# EasyEDA Pro project ir2104_V2.1.eprj

# Schematic Schematic1
Create Date: 2023-10-16; Page Name: P1_1; Project Name: ir2104_V2; Schematic Name: Schematic1; Update Date: 2023-10-16; Company: 嘉立创EDA; Page Size: A4; Version: V1.0
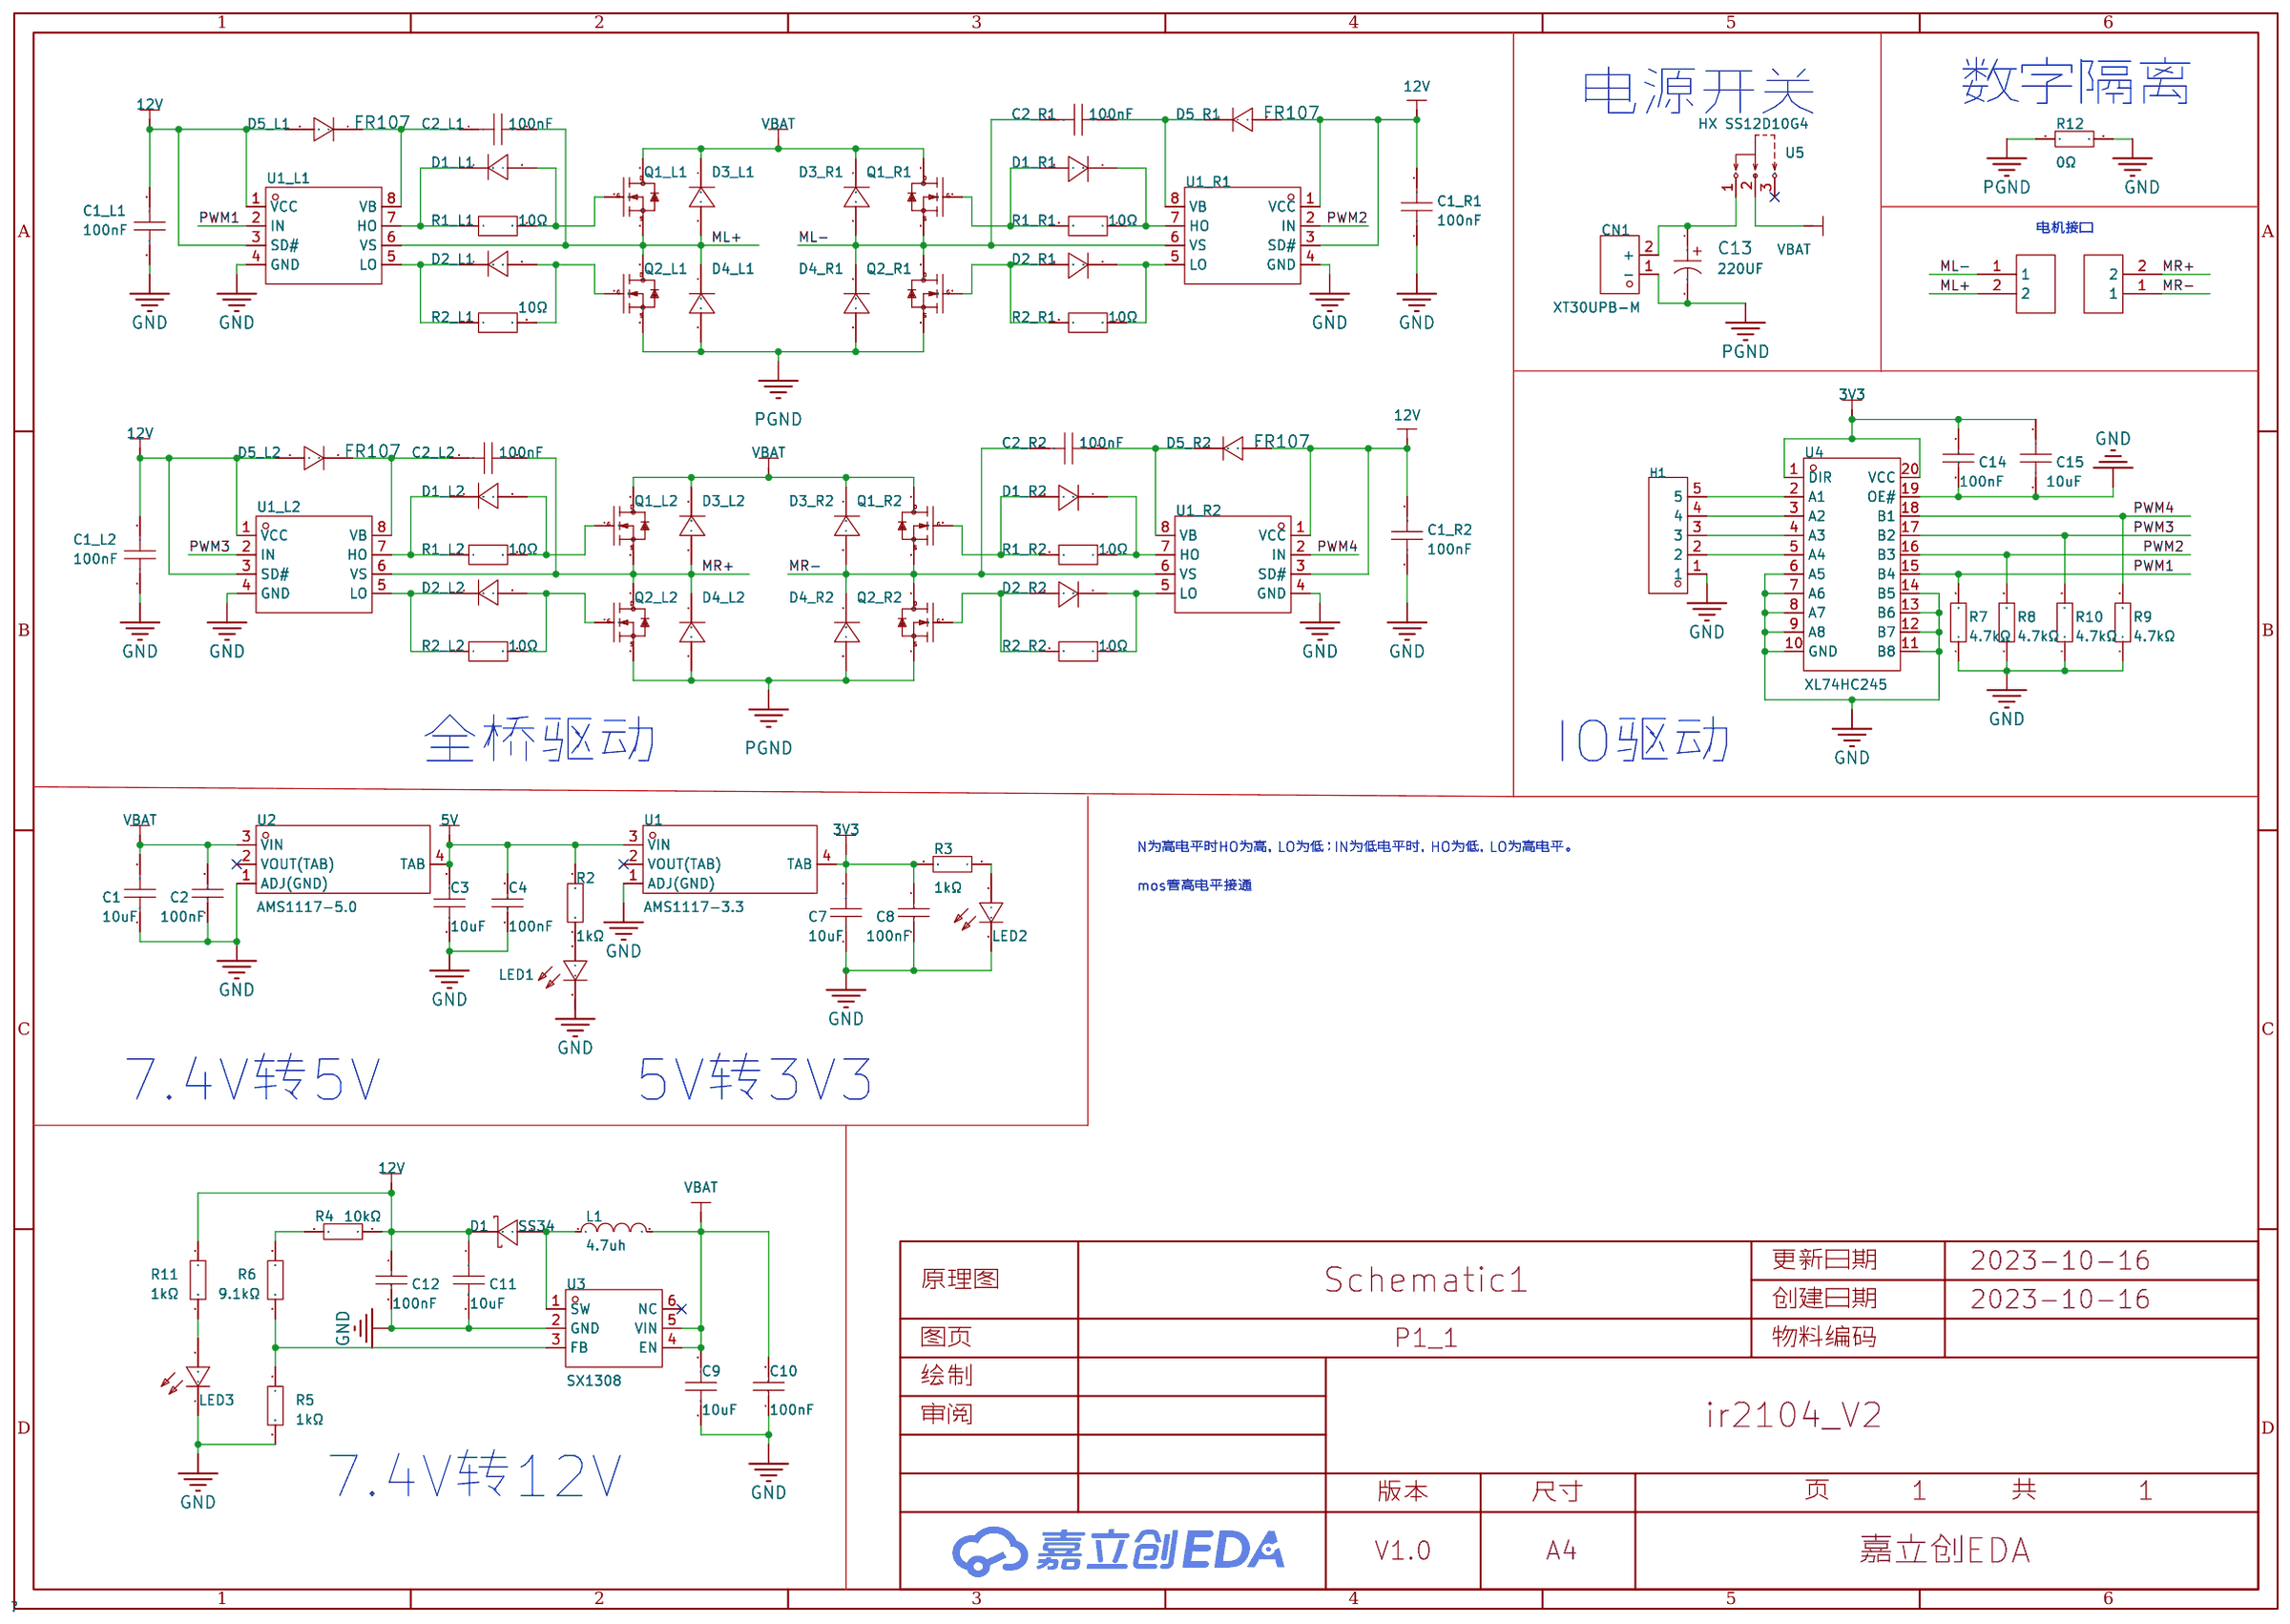
[diagram p0: schematic sheet]

## Parts
C1  10uF  [C0603]
C1_L1  100nF  [C0603]
C1_L2  100nF  [C0603]
C1_R1  100nF  [C0603]
C1_R2  100nF  [C0603]
C2  100nF  [C0603]
C2_L1  100nF  [C0603]
C2_L2  100nF  [C0603]
C2_R1  100nF  [C0603]
C2_R2  100nF  [C0603]
C3  10uF  [C0603]
C4  100nF  [C0603]
C7  10uF  [C0603]
C8  100nF  [C0603]
C9  10uF  [C0603]
C10  100nF  [C0603]
C11  10uF  [C0603]
C12  100nF  [C0603]
C13  220UF  [CAP-SMD_BD8.0-L8.3-W8.3-LS9.3-FD]
C14  100nF  [C0603]
C15  10uF  [C0603]
CN1  XT30UPB-M  [CONN-TH_XT30UPB-M]
D1  SS34  [SMA_L4.3-W2.6-LS5.2-RD]
D1_L1  US1M  [SMA_L4.4-W2.8-LS5.4-RD]
D1_L2  US1M  [SMA_L4.4-W2.8-LS5.4-RD]
D1_R1  US1M  [SMA_L4.4-W2.8-LS5.4-RD]
D1_R2  US1M  [SMA_L4.4-W2.8-LS5.4-RD]
D2_L1  US1M  [SMA_L4.4-W2.8-LS5.4-RD]
D2_L2  US1M  [SMA_L4.4-W2.8-LS5.4-RD]
D2_R1  US1M  [SMA_L4.4-W2.8-LS5.4-RD]
D2_R2  US1M  [SMA_L4.4-W2.8-LS5.4-RD]
D3_L1  US1M  [SMA_L4.4-W2.8-LS5.4-RD]
D3_L2  US1M  [SMA_L4.4-W2.8-LS5.4-RD]
D3_R1  US1M  [SMA_L4.4-W2.8-LS5.4-RD]
D3_R2  US1M  [SMA_L4.4-W2.8-LS5.4-RD]
D4_L1  US1M  [SMA_L4.4-W2.8-LS5.4-RD]
D4_L2  US1M  [SMA_L4.4-W2.8-LS5.4-RD]
D4_R1  US1M  [SMA_L4.4-W2.8-LS5.4-RD]
D4_R2  US1M  [SMA_L4.4-W2.8-LS5.4-RD]
D5_L1  FR107  [SOD-123_L2.8-W1.8-LS3.7-RD]
D5_L2  FR107  [SOD-123_L2.8-W1.8-LS3.7-RD]
D5_R1  FR107  [SOD-123_L2.8-W1.8-LS3.7-RD]
D5_R2  FR107  [SOD-123_L2.8-W1.8-LS3.7-RD]
H1  PZ254V-11-05P  [HDR-TH_5P-P2.54-V-M]
L1  4.7uh  [IND-SMD_L7.3-W6.6]
LED1  NCD0603R1  [LED0603-RD_RED]
LED2  NCD0603R1  [LED0603-RD_RED]
LED3  NCD0603R1  [LED0603-RD_RED]
P1  WJ500V-5.08-2P  [CONN-TH_2P-P5.00_WJ500V-5.08-2P]
P2  WJ500V-5.08-2P  [CONN-TH_2P-P5.00_WJ500V-5.08-2P]
Q1_L1  IRFR3607TRPBF  [TO-252-3_L6.5-W5.8-P4.58-BL]
Q1_L2  IRFR3607TRPBF  [TO-252-3_L6.5-W5.8-P4.58-BL]
Q1_R1  IRFR3607TRPBF  [TO-252-3_L6.5-W5.8-P4.58-BL]
Q1_R2  IRFR3607TRPBF  [TO-252-3_L6.5-W5.8-P4.58-BL]
Q2_L1  IRFR3607TRPBF  [TO-252-3_L6.5-W5.8-P4.58-BL]
Q2_L2  IRFR3607TRPBF  [TO-252-3_L6.5-W5.8-P4.58-BL]
Q2_R1  IRFR3607TRPBF  [TO-252-3_L6.5-W5.8-P4.58-BL]
Q2_R2  IRFR3607TRPBF  [TO-252-3_L6.5-W5.8-P4.58-BL]
R1_L1  10Ω  [R0603]
R1_L2  10Ω  [R0603]
R1_R1  10Ω  [R0603]
R1_R2  10Ω  [R0603]
R2  1kΩ  [R0603]
R2_L1  10Ω  [R0603]
R2_L2  10Ω  [R0603]
R2_R1  10Ω  [R0603]
R2_R2  10Ω  [R0603]
R3  1kΩ  [R0603]
R4  10kΩ  [R0603]
R5  1kΩ  [R0603]
R6  9.1kΩ  [R0603]
R7  4.7kΩ  [R0603]
R8  4.7kΩ  [R0603]
R9  4.7kΩ  [R0603]
R10  4.7kΩ  [R0603]
R11  1kΩ  [R0603]
R12  0Ω  [R0805]
U1  AMS1117-3.3  [SOT-223-4_L6.5-W3.5-P2.30-LS7.0-BR]
U1_L1  EG2104  [SOP-8_L5.0-W4.0-P1.27-LS6.2-BL]
U1_L2  EG2104  [SOP-8_L5.0-W4.0-P1.27-LS6.2-BL]
U1_R1  EG2104  [SOP-8_L5.0-W4.0-P1.27-LS6.2-BL]
U1_R2  EG2104  [SOP-8_L5.0-W4.0-P1.27-LS6.2-BL]
U2  AMS1117-5.0  [SOT-223_L6.7-W3.5-P2.30-BR]
U3  SX1308  [SOT-23-6_L2.9-W1.6-P0.95-LS2.8-BL]
U4  XL74HC245  [SOP-20_L12.8-W7.5-P1.27-LS10.4-BL]
U5  HX SS12D10G4  [SW-TH_SHOU-HAN_SS12D10G4]

## Library data of the parts
C1 C3 C7 C9 C11 C15 = CL10A106MA8NRNC: 容值:10uF;精度:±20%;额定电压:25V;材质(温度系数):X5R;; LCSC Part Name: 10uF ±20% 25V; Supplier Part: C96446; Manufacturer: SAMSUNG(三星); Supplier Footprint: 0603; JLCPCB Part Class: Basic Part; Datasheet: https://atta.szlcsc.com/upload/public/pdf/source/20170325/1490427913016.pdf; Supplier: LCSC; Tolerance: ±20%; Voltage Rated: 25V; Temperature Coefficient: X5R
C1_L1 C1_L2 C1_R1 C1_R2 C2_L1 C2_L2 C2_R1 C2_R2 = CL10B104KB8NNNC: 容值:100nF;精度:±10%;额定电压:50V;材质(温度系数):X7R;; LCSC Part Name: 100nF±10%50V; Supplier Part: C1591; Manufacturer: SAMSUNG(三星); Supplier Footprint: 0603; JLCPCB Part Class: 扩展库; Datasheet: https://atta.szlcsc.com/upload/public/pdf/source/20160103/1457707680512.pdf; Supplier: LCSC; Tolerance: ±10%; Voltage Rated: 50V; Temperature Coefficient: X7R
C2 C4 C8 C10 C12 C14 = 0603B104K500NT: 容值:100nF;精度:±10%;额定电压:50V;材质(温度系数):X7R;; LCSC Part Name: 100nF ±10% 50V; Supplier Part: C30926; Manufacturer: FH(风华); Supplier Footprint: 0603; JLCPCB Part Class: Extended Part; Datasheet: https://atta.szlcsc.com/upload/public/pdf/source/20170923/C30926_1506149436298988724.pdf; Supplier: LCSC; Tolerance: ±10%; Voltage Rated: 50V; Temperature Coefficient: X7R
C13 = FZ470UF16V90RV0148: LCSC Part Name: 贴片型铝电解电容 470UF 16V; Supplier Part: C5155342; Manufacturer: KNSCHA(科尼盛); Supplier Footprint: SMD,8x10.5mm; JLCPCB Part Class: Extended Part; Supplier: LCSC
CN1 = XT30UPB-M: LCSC Part Name: AMASS(艾迈斯)板载立式 航模锂电池控制器连接器插头 公头XT30UPB-M; Supplier Part: C428721; Manufacturer: AMASS(艾迈斯); JLCPCB Part Class: Extended Part; Datasheet: https://atta.szlcsc.com/upload/public/pdf/source/20230412/7B5DFEF57C9EA5273853390C734B3AC5.pdf; Supplier: LCSC
D1 = SS34_C8678: 二极管配置:独立式;直流反向耐压(Vr):40V;平均整流电流(Io):3A;正向压降(Vf):550mV@3A;; LCSC Part Name: 40V 3A 550mV@3A; Supplier Part: C8678; Manufacturer: MDD; Supplier Footprint: SMA(DO-214AC); JLCPCB Part Class: Basic Part; Datasheet: https://atta.szlcsc.com/upload/public/pdf/source/20230314/A80AE34493C69B89E2F4B1712F433538.pdf; Supplier: LCSC; Diode Configuration: 独立式; Reverse Voltage (Vr): 40V; Average Rectified Current (Io): 3A; Forward Voltage (Vf@If): 550mV@3A; Reverse Leakage Current (Ir): 500uA@40V
D1_L1 D1_L2 D1_R1 D1_R2 D2_L1 D2_L2 D2_R1 D2_R2 D3_L1 D3_L2 D3_R1 D3_R2 D4_L1 D4_L2 D4_R1 D4_R2 = US1M_C412437: 二极管配置:独立式;直流反向耐压(Vr):1kV;平均整流电流(Io):1A;正向压降(Vf):1.7V@1A;反向电流(Ir):5uA@1kV;反向恢复时间(trr):75ns;工作温度:-50℃~+150℃@(Tj);; LCSC Part Name: 1kV1A75ns; Supplier Part: C412437; Manufacturer: MDD; Supplier Footprint: SMA; JLCPCB Part Class: BasicPart; Datasheet: https://atta.szlcsc.com/upload/public/pdf/source/20200710/C412437_A2B0E4A2AF6F53946A2ACCD8257B288E.pdf; Supplier: LCSC; Diode Configuration: 独立式; Reverse Voltage (Vr): 1kV; Average Rectified Current (Io): 1A; Forward Voltage (Vf@If): 1.7V@1A; Reverse Leakage Current: 5uA@1kV; Reverse Recovery Time (trr): 75ns; Operating Temperature: -50℃~+150℃@(Tj)
D5_L1 D5_L2 D5_R1 D5_R2 = FR107_C511885: 二极管配置:-;直流反向耐压(Vr):1kV;平均整流电流(Io):1A;正向压降(Vf):1.3V@1A;反向电流(Ir):5uA@1kV;反向恢复时间(trr):500ns;工作温度:-55℃~+150℃@(Tj);; LCSC Part Name: 1kV1A500ns; Supplier Part: C511885; Manufacturer: BORN(伯恩半导体); Supplier Footprint: SOD-123; JLCPCB Part Class: 扩展库; Datasheet: https://atta.szlcsc.com/upload/public/pdf/source/20200413/C511885_F5BBF7A87475723E74BE0D118A106A7A.pdf; Supplier: LCSC; Reverse Voltage (Vr): 1kV; Average Rectified Current (Io): 1A; Forward Voltage (Vf@If): 1.3V@1A; Reverse Leakage Current: 5uA@1kV; Reverse Recovery Time (trr): 500ns; Operating Temperature: -55℃~+150℃@(Tj)
H1 = PZ254V-11-05P: 排数:单排;总PIN位数:5P;间距:2.54mm;插针结构:1x5P;行距:-;安装类型:直插;圆针/方针:方针;额定电流:-;额定电压:-;配合针长度:6mm;塑高:2.5mm;端接针长度:3mm;触头材质:黄铜;触头镀层:-;工作温度范围:-40℃~+105℃;颜色:黑色;; LCSC Part Name: 2.54mm 1x5P 直插 方针; Supplier Part: C492404; Manufacturer: XFCN(兴飞); Supplier Footprint: 插件,P=2.54mm; JLCPCB Part Class: Extended Part; Datasheet: https://atta.szlcsc.com/upload/public/pdf/source/20200309/C492404_E51533260F8710EFF5D4617281164C1D.pdf; Supplier: LCSC; Number of Rows: 单排; Number of Pins: 5P; Pitch: 2.54mm; Pin Structure: 1x5P; Mounting Type: 直插; Circluar Pins/Square Pins: 方针; Length of Mating Pin: 6mm; Insulation Height: 2.5mm; Length of End Connection Pin: 3mm; Contact Material: 黄铜; Operating Temperature Range: -40℃~+105℃; Color: 黑色
L1 = SMMS0630-100M: 电感值:10uH;精度:±20%;额定电流:-;; LCSC Part Name: 10uH ±20%; Supplier Part: C128692; Manufacturer: SXN(顺翔诺); Supplier Footprint: SMD,6.6x7.3mm; JLCPCB Part Class: 扩展库; Datasheet: https://atta.szlcsc.com/upload/public/pdf/source/20210810/BBF24330FB2F5029F637830BA9C42C0D.pdf; Supplier: LCSC; Tolerance: ±20%
LED1-LED3 = NCD0603R1_C84263: 发光颜色:红灯;; LCSC Part Name: 红灯; Supplier Part: C84263; Manufacturer: 国星光电; Supplier Footprint: 0603; JLCPCB Part Class: Extended Part; Datasheet: https://atta.szlcsc.com/upload/public/pdf/source/20200820/C84263_DABC6A75E58F576973B407FDBA283D60.pdf; Supplier: LCSC; Emitted Color: 红灯
P1 P2 = WJ500V-5.08-2P: 间距:5.08mm;结构:1x2P;排数:1;每排PIN数:2;安装方式:直针;额定电流:18A;额定电压:250V;线规 - AWG:14~30;线规 - mm2:2.5;工作温度范围:-40℃~+105℃;颜色:绿色;; LCSC Part Name: 5.08mm 1x2P 排数:1 每排P数:2 直针 可拼接; Supplier Part: C8465; Manufacturer: KANGNEX(康奈克斯电气); Supplier Footprint: 插件,P=5.08mm; JLCPCB Part Class: 扩展库; Datasheet: https://atta.szlcsc.com/upload/public/pdf/source/20191225/C8465_02D34CE5B5B4A53DF5891601D97FA9F4.pdf; Supplier: LCSC; Pitch: 5.08mm; Structure: 1x2P; Number of Rows: 1; Number of PINs Per Row: 2; Mounting Style: 直针; Current Rating (Max): 18A; Voltage Rating (Max): 250V; Wire Gauge - AWG: 14~30; Wire Gauge - mm2: 2.5; Operating Temperature Range: -40℃~+105℃; Color: 绿色
Q1_L1 Q1_L2 Q1_R1 Q1_R2 Q2_L1 Q2_L2 Q2_R1 Q2_R2 = IRFR3607TRPBF: 类型:N沟道;漏源电压(Vdss):75V;连续漏极电流(Id):56A;功率(Pd):140W;导通电阻(RDS(on)@Vgs,Id):9mΩ@10V,46A;阈值电压(Vgs(th)@Id):4V@100uA;; LCSC Part Name: N沟道75V56A; Supplier Part: C74775; Manufacturer: Infineon(英飞凌); Supplier Footprint: TO-252-2(DPAK); JLCPCB Part Class: 扩展库; Datasheet: https://atta.szlcsc.com/upload/public/pdf/source/20180125/C74775_15168616818461301901.pdf; Supplier: LCSC; Type: N沟道; Drain Source Voltage (Vdss): 75V; Continuous Drain Current (Id): 56A; Power Dissipation (Pd): 140W; Drain Source On Resistance (RDS(on)@Vgs,Id): 9mΩ@10V,46A; Gate Threshold Voltage (Vgs(th)@Id): 4V@100uA
R1_L1 R1_L2 R1_R1 R1_R2 R2_L1 R2_L2 R2_R1 R2_R2 = ERJUP3D10R0V: 阻值:10Ω;精度:±0.5%;功率:250mW;; LCSC Part Name: 10Ω±0.5%250mW; Supplier Part: C491216; Manufacturer: PANASONIC(松下); Supplier Footprint: 0603; JLCPCB Part Class: 扩展库; Datasheet: https://atta.szlcsc.com/upload/public/pdf/source/20200407/C491216_2E39EC09AE614A2EE2B1246D53854D38.pdf; Supplier: LCSC; Tolerance: ±0.5%; Power(Watts): 250mW
R2 R3 R11 = 0603WAF1001T5E: 电阻类型:厚膜电阻;阻值:1kΩ;精度:±1%;功率:100mW;; LCSC Part Name: 1kΩ ±1% 100mW; Supplier Part: C21190; Manufacturer: UNI-ROYAL(厚声); Supplier Footprint: 0603; JLCPCB Part Class: Basic Part; Datasheet: https://atta.szlcsc.com/upload/public/pdf/source/20200306/C422600_1E6D84923E4A46A82E41ADD87F860B5C.pdf; Supplier: LCSC; Type: 厚膜电阻; Tolerance: ±1%; Power(Watts): 100mW; Temperature Coefficient: ±100ppm/℃; Overload Voltage (Max): 75V; Operating Temperature Range: -55℃~+155℃
R4 = RT0603BRD0710KL: 电阻类型:薄膜电阻;阻值:10kΩ;精度:±0.1%;功率:100mW;; LCSC Part Name: 10kΩ ±0.1% 100mW; Supplier Part: C95204; Manufacturer: YAGEO(国巨); Supplier Footprint: 0603; JLCPCB Part Class: Extended Part; Datasheet: https://atta.szlcsc.com/upload/public/pdf/source/20170217/1487301593756.pdf; Supplier: LCSC; Type: 薄膜电阻; Tolerance: ±0.1%; Power(Watts): 100mW; Temperature Coefficient: ±25ppm/℃; Overload Voltage (Max): 75V; Operating Temperature Range: -55℃~+155℃
R5 = RT0603BRD071KL: 电阻类型:薄膜电阻;阻值:1kΩ;精度:±0.1%;功率:100mW;; LCSC Part Name: 1kΩ ±0.1% 100mW; Supplier Part: C110776; Manufacturer: YAGEO(国巨); Supplier Footprint: 0603; JLCPCB Part Class: Extended Part; Datasheet: https://atta.szlcsc.com/upload/public/pdf/source/20170704/1499151282044.pdf; Supplier: LCSC; Type: 薄膜电阻; Tolerance: ±0.1%; Power(Watts): 100mW; Temperature Coefficient: ±25ppm/℃; Overload Voltage (Max): 75V; Operating Temperature Range: -55℃~+155℃
R6 = PTFR0603B9K10P9: 电阻类型:薄膜电阻;阻值:9.1kΩ;精度:±0.1%;功率:100mW;; LCSC Part Name: 9.1kΩ ±0.1% 100mW; Supplier Part: C351620; Manufacturer: RESI(开步睿思）; Supplier Footprint: 0603; JLCPCB Part Class: Extended Part; Datasheet: https://atta.szlcsc.com/upload/public/pdf/source/20200421/C328426_1F8A6F869BB4A34F9E140D3E05CCCC70.pdf; Supplier: LCSC; Type: 薄膜电阻; Tolerance: ±0.1%; Power(Watts): 100mW; Temperature Coefficient: ±25ppm/℃; Overload Voltage (Max): 100V; Operating Temperature Range: -55℃~+125℃
R7-R10 = 0603WAF4701T5E: 电阻类型:厚膜电阻;阻值:4.7kΩ;精度:±1%;功率:100mW;; LCSC Part Name: 4.7kΩ ±1% 100mW; Supplier Part: C23162; Manufacturer: UNI-ROYAL(厚声); Supplier Footprint: 0603; JLCPCB Part Class: Basic Part; Datasheet: https://atta.szlcsc.com/upload/public/pdf/source/20200306/C422600_1E6D84923E4A46A82E41ADD87F860B5C.pdf; Supplier: LCSC; Type: 厚膜电阻; Tolerance: ±1%; Power(Watts): 100mW; Temperature Coefficient: ±100ppm/℃; Overload Voltage (Max): 75V; Operating Temperature Range: -55℃~+155℃
R12 = 0805W8F0000T5E: 电阻类型:厚膜电阻;阻值:0Ω;精度:±1%;功率:125mW;; LCSC Part Name: 0Ω ±1% 125mW; Supplier Part: C17477; Manufacturer: UNI-ROYAL(厚声); Supplier Footprint: 0805; JLCPCB Part Class: Basic Part; Datasheet: https://atta.szlcsc.com/upload/public/pdf/source/20200306/C422600_1E6D84923E4A46A82E41ADD87F860B5C.pdf; Supplier: LCSC; Type: 厚膜电阻; Tolerance: ±1%; Power(Watts): 125mW; Temperature Coefficient: ±800ppm/℃; Overload Voltage (Max): 150V; Operating Temperature Range: -55℃~+155℃
U1 = AMS1117-3.3_C347222: 输出类型:固定;输出极性:正;最大输入电压:18V;输出电压:3.3V;输出电流:1A;电源纹波抑制比(PSRR):60dB@(120Hz);; Supplier Part: C347222; Manufacturer: UMW(广东友台半导体); Supplier Footprint: SOT-223; JLCPCB Part Class: Extended Part; Datasheet: https://atta.szlcsc.com/upload/public/pdf/source/20211011/50CC665C22E3A66C08379A4A74BDA25C.pdf; Supplier: LCSC; Output Type: 固定; Output Polarity: 正; Number of Outputs: 1; Maximum Input Voltage: 18V; Output Voltage: 3.3V; Dropout Voltage: 1.3V@(1A); Output Current: 1A; Power Supply Rejection Ratio (PSRR): 60dB@(120Hz)
U1_L1 U1_L2 U1_R1 U1_R2 = EG2104: 高性价比,600V，半桥式Nmos预驱动器; Supplier Part: C186697; Manufacturer: EG(屹晶微); Supplier Footprint: SOP-8-150mil; JLCPCB Part Class: 扩展库; Datasheet: https://atta.szlcsc.com/upload/public/pdf/source/20220627/4CCFA0CAB664067FEE4AF87E4129127F.pdf; Supplier: LCSC
U2 = AMS1117-5.0_C347223: 输出类型:固定;输出极性:正;最大输入电压:18V;输出电压:5V;输出电流:1A;电源纹波抑制比(PSRR):60dB@(120Hz);; LCSC Part Name: 输入18V 输出5V 1A; Supplier Part: C347223; Manufacturer: UMW(广东友台半导体); Supplier Footprint: SOT-223; JLCPCB Part Class: Extended Part; Datasheet: https://atta.szlcsc.com/upload/public/pdf/source/20211011/50CC665C22E3A66C08379A4A74BDA25C.pdf; Supplier: LCSC; Output Type: 固定; Output Polarity: 正; Number of Outputs: 1; Maximum Input Voltage: 18V; Output Voltage: 5V; Dropout Voltage: 1.3V@(1A); Output Current: 1A; Power Supply Rejection Ratio (PSRR): 60dB@(120Hz)
U3 = SX1308: 功能类型:升压型;同步整流:否;输出通道数:1;拓扑结构:升压式;输入电压:2V~24V;输出电压:28V;输出电流(最大值):-;开关频率:1.2MHz;; LCSC Part Name: 升压型 Vin=2V~24V Vout=28V; Supplier Part: C78162; Manufacturer: SX(硕芯科技); Supplier Footprint: SOT-23-6; JLCPCB Part Class: Extended Part; Datasheet: https://atta.szlcsc.com/upload/public/pdf/source/20160920/1474356679185.pdf; Supplier: LCSC; Function: 升压型; Synchronous Rectification: 否; Number of Outputs: 1; Topology: 升压式; Input Voltage: 2V~24V; Output Voltage: 28V; Switching Frequency: 1.2MHz
U4 = XL74HC245: 八路总线收发器; LCSC Part Name: 总线收发器; Supplier Part: C561304; Manufacturer: XINLUDA(信路达); Supplier Footprint: SOP-20; JLCPCB Part Class: Extended Part; Datasheet: https://atta.szlcsc.com/upload/public/pdf/source/20200529/C561304_A214D245EEE9B91D1EB7AEB54AB3B76F.pdf; Supplier: LCSC
U5 = HX SS12D10G4: LCSC Part Name: 拨动开关 立式两档拨动,单排3脚插件,12.7x6.7x6.4,黑柄4mm; Supplier Part: C5149841; Manufacturer: hanxia(韩下); Supplier Footprint: 插件; JLCPCB Part Class: 扩展库; Datasheet: https://atta.szlcsc.com/upload/public/pdf/source/20220907/2020D7183ED16DD6E2B9F5A13FB144CF.pdf; Supplier: LCSC

## Nets
3V3: C7.2 C8.2 C14.1 C15.1 R3.2 U1.4(TAB) U4.1(DIR) U4.20(VCC)
5V: C3.2 C4.2 R2.1 U1.3(VIN) U2.4(TAB)
12V: C1_L1.2 C1_L2.2 C1_R1.2 C1_R2.2 C11.1 C12.1 D1.1(K) D5_L1.2(A) D5_L2.2(A) D5_R1.2(A) D5_R2.2(A) R4.1 R11.1 U1_L1.1(VCC) U1_L1.3(SD#) U1_L2.1(VCC) U1_L2.3(SD#) U1_R1.1(VCC) U1_R1.3(SD#) U1_R2.1(VCC) U1_R2.3(SD#)
GND: C1.1 C1_L1.1 C1_L2.1 C1_R1.1 C1_R2.1 C2.1 C3.1 C4.1 C7.1 C8.1 C9.1 C10.1 C11.2 C12.2 C14.2 C15.2 H1.1 LED1.1(K) LED2.1(K) LED3.1(K) R5.2 R7.1 R8.1 R9.1 R10.1 R12.2 U1.1(ADJ(GND)) U1_L1.4(GND) U1_L2.4(GND) U1_R1.4(GND) U1_R2.4(GND) U2.1(ADJ(GND)) U3.2(GND) U4.6(A5) U4.7(A6) U4.8(A7) U4.9(A8) U4.10(GND) U4.11(B8) U4.12(B7) U4.13(B6) U4.14(B5) U4.19(OE#)
PGND: C13.2 CN1.1(-) D4_L1.2(A) D4_L2.2(A) D4_R1.2(A) D4_R2.2(A) Q2_L1.3(S) Q2_L2.3(S) Q2_R1.3(S) Q2_R2.3(S) R12.1
VBAT: C1.2 C2.2 C9.2 C10.2 D3_L1.1(C) D3_L2.1(C) D3_R1.1(C) D3_R2.1(C) L1.2 Q1_L1.2(D) Q1_L2.2(D) Q1_R1.2(D) Q1_R2.2(D) U2.3(VIN) U3.4(EN) U3.5(VIN) U5.2
ML+: C2_L1.2 D3_L1.2(A) D4_L1.1(C) P1.2 Q1_L1.3(S) Q2_L1.2(D) U1_L1.6(VS)
ML-: C2_R1.2 D3_R1.2(A) D4_R1.1(C) P1.1 Q1_R1.3(S) Q2_R1.2(D) U1_R1.6(VS)
MR+: C2_L2.2 D3_L2.2(A) D4_L2.1(C) P2.2 Q1_L2.3(S) Q2_L2.2(D) U1_L2.6(VS)
MR-: C2_R2.2 D3_R2.2(A) D4_R2.1(C) P2.1 Q1_R2.3(S) Q2_R2.2(D) U1_R2.6(VS)
PWM1: R7.2 U1_L1.2(IN) U4.15(B4)
PWM2: R8.2 U1_R1.2(IN) U4.16(B3)
PWM3: R10.2 U1_L2.2(IN) U4.17(B2)
PWM4: R9.2 U1_R2.2(IN) U4.18(B1)
$3N995: D2_L1.2(A) Q2_L1.1(G) R2_L1.2
$3N996: D1_L1.1(C) R1_L1.1 U1_L1.7(HO)
$3N997: D2_L1.1(C) R2_L1.1 U1_L1.5(LO)
$3N999: C2_L1.1 D5_L1.1(K) U1_L1.8(VB)
$3N1006: D1_R1.1(C) R1_R1.1 U1_R1.7(HO)
$3N1007: D1_R1.2(A) Q1_R1.1(G) R1_R1.2
$3N1008: D2_R1.1(C) R2_R1.1 U1_R1.5(LO)
$3N1009: D2_R1.2(A) Q2_R1.1(G) R2_R1.2
$3N1011: C2_R1.1 D5_R1.1(K) U1_R1.8(VB)
$3N1019: D1_L1.2(A) Q1_L1.1(G) R1_L1.2
$3N2169: D2_L2.2(A) Q2_L2.1(G) R2_L2.2
$3N2170: D1_L2.1(C) R1_L2.1 U1_L2.7(HO)
$3N2171: D2_L2.1(C) R2_L2.1 U1_L2.5(LO)
$3N2173: C2_L2.1 D5_L2.1(K) U1_L2.8(VB)
$3N2190: D1_R2.1(C) R1_R2.1 U1_R2.7(HO)
$3N2191: D1_R2.2(A) Q1_R2.1(G) R1_R2.2
$3N2192: D2_R2.1(C) R2_R2.1 U1_R2.5(LO)
$3N2193: D2_R2.2(A) Q2_R2.1(G) R2_R2.2
$3N2195: C2_R2.1 D5_R2.1(K) U1_R2.8(VB)
$3N2213: D1_L2.2(A) Q1_L2.1(G) R1_L2.2
$3N2727: LED2.2(A) R3.1
$3N2731: LED1.2(A) R2.2
$3N3245: D1.2(A) L1.1 U3.1(SW)
$3N3247: R4.2 R6.2
$3N3248: R5.1 R6.1 U3.3(FB)
$3N3249: LED3.2(A) R11.2
$3N4108: C13.1 CN1.2(+) U5.1
$3N4523: H1.2 U4.5(A4)
$3N4524: H1.3 U4.4(A3)
$3N4525: H1.4 U4.3(A2)
$3N4526: H1.5 U4.2(A1)

Not connected (* = marked no-connect by the designer): U1 2(VOUT(TAB))*; U2 2(VOUT(TAB))*; U3 6(NC)*; U5 3*

## Notes on the sheet
- 数字隔离
- 电源开关
- 电机接口
- 全桥驱动
- IO驱动
- N为高电平时HO为高，LO为低；IN为低电平时，HO为低，LO为高电平。
- mos管高电平接通
- 7.4V转5V
- 5V转3V3
- 7.4V转12V

# Board PCB1
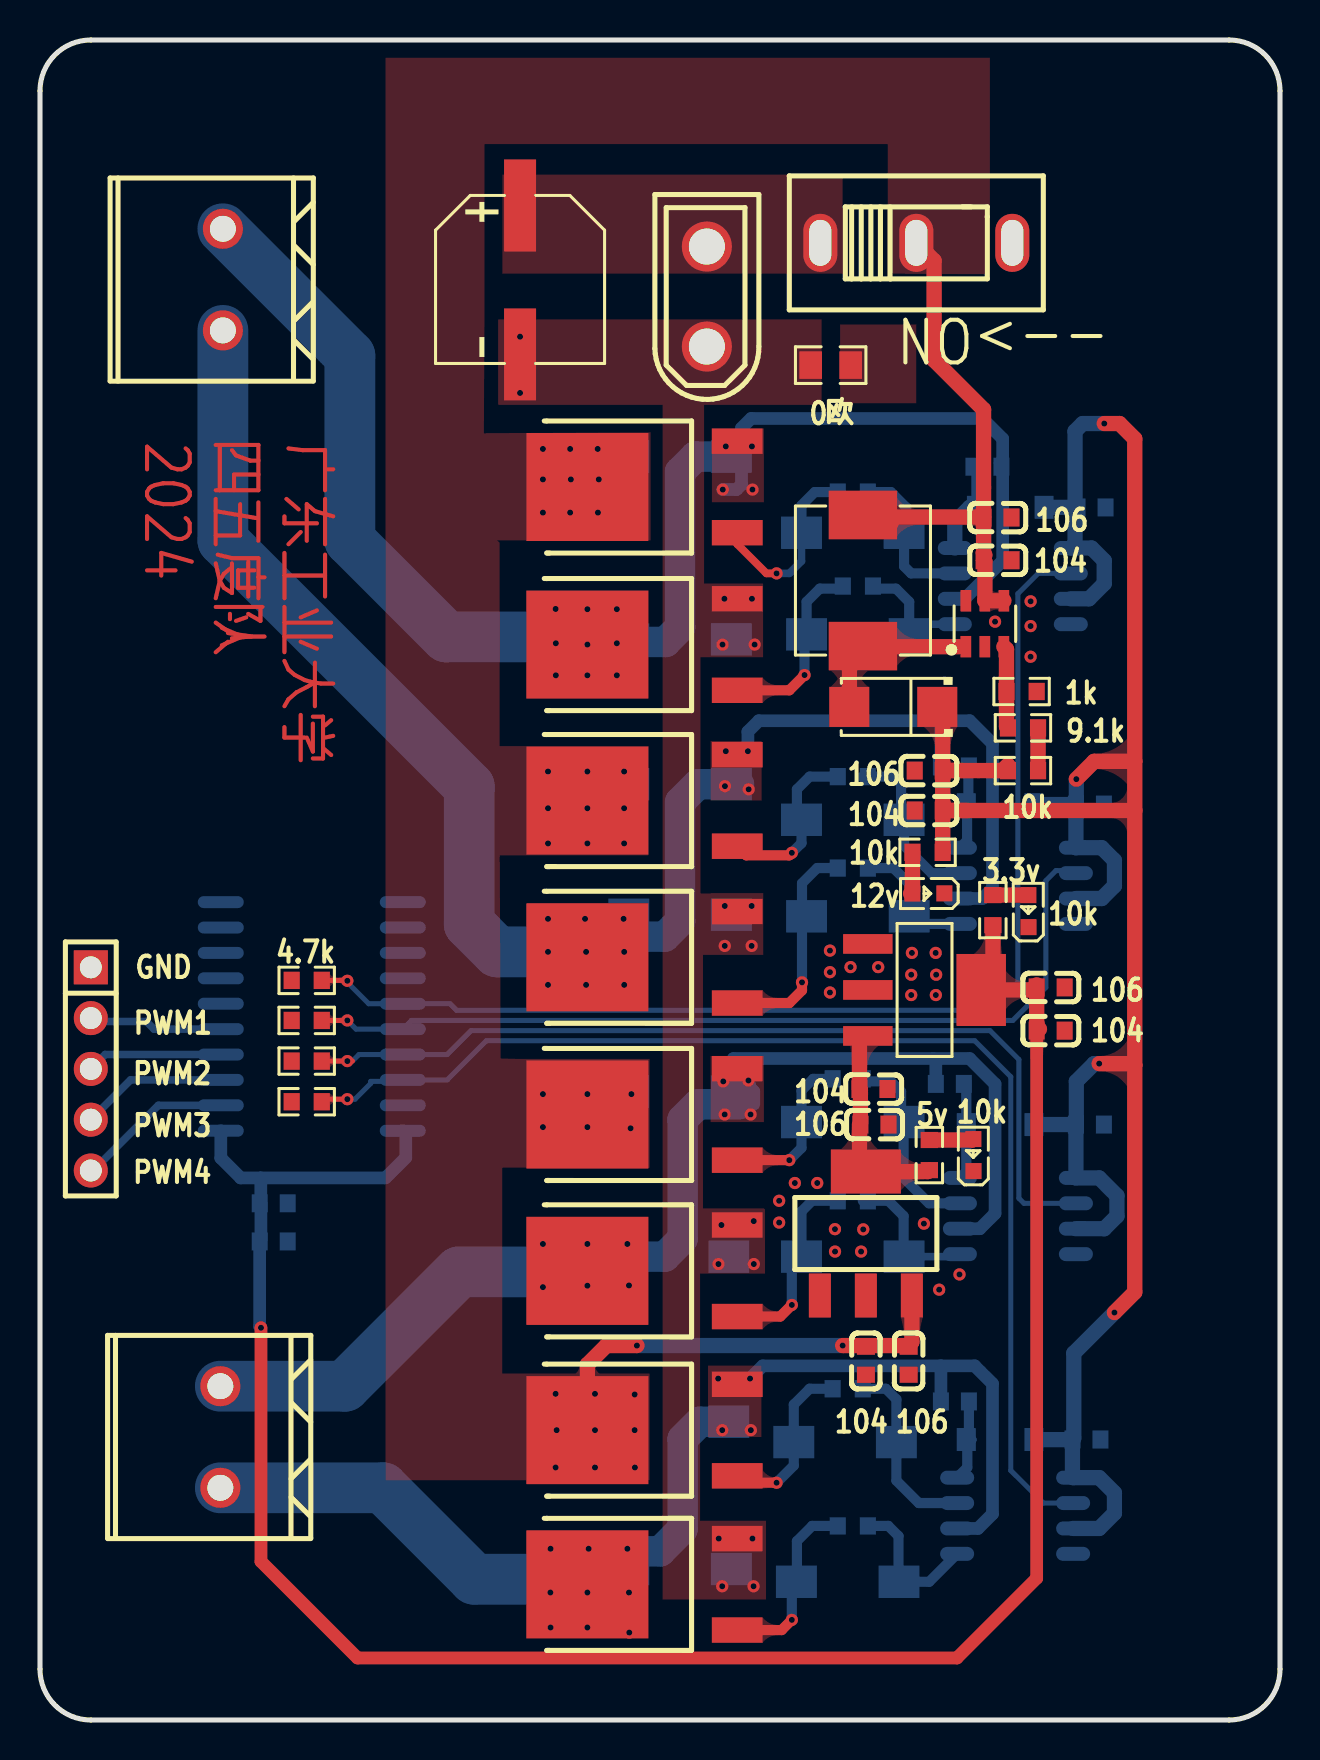
[diagram p1: board, top side]
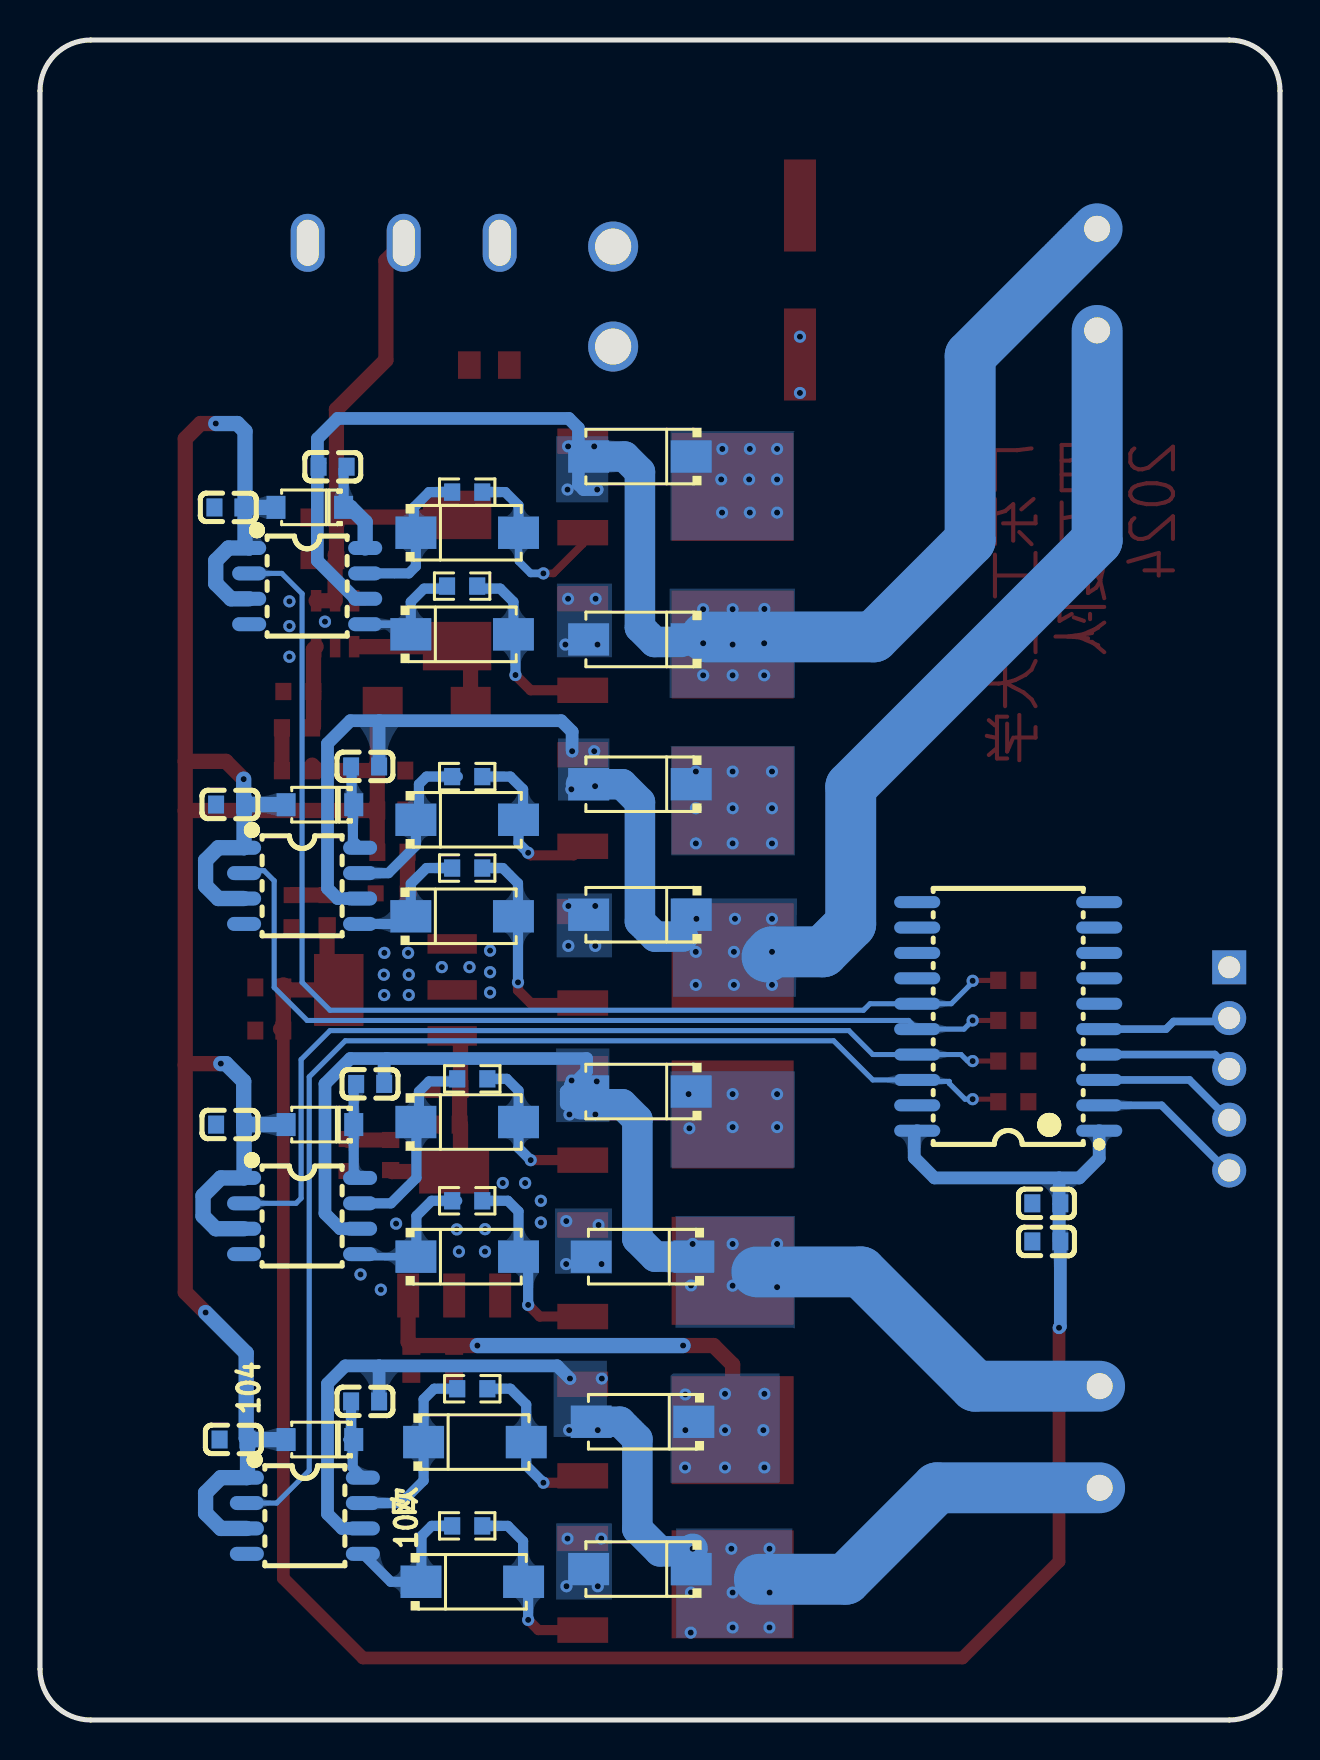
[diagram p2: board, bottom side, seen from below]

Outline 62 x 84 mm; copper layers: Top Layer, Bottom Layer. Coordinates in mm from the lower left corner of the outline.
Outline path: 0,81.46 0,2.54 arc(0.74,0.74) 2.54,0 59.46,0 arc(61.26,0.74) 62,2.54 62,81.46 arc(61.26,83.26) 59.46,84 2.54,84 arc(0.74,83.26) 0,81.46
Stack: Top Layer 0.035mm / Dielectric1 1.51mm FR4 er 4.5 / Bottom Layer 0.035mm

## Design rules (mm)
template: JLCPCB Capability(Two Layers Board)
spacing copperThickness1oz (default): track to track 0.102, other pairs 0.152 to 0.3
spacing copperThickness2oz: track to track 0.203, other pairs 0.152 to 0.3
track width copperThickness1oz (default): min 0.127, default 0.254, max 2.54
track width copperThickness2oz: min 0.203, default 0.254, max 2.54
differential pair differentialPair (default): width min 0.127, default 0.254, max 2.54; gap min 0.152, default 0.152
via viaSize (default): diameter min 0.5, default 0.61, max 10; hole min 0.3, default 0.305, max 6.3

## Placement (name value [footprint] x y rotation side)
C1  10uF  [C0603]  43.43 17.96 90 top
C1_L1  100nF  [C0603]  52.58 60.63 180 bottom
C1_L2  100nF  [C0603]  52.49 29.77 180 bottom
C1_R1  100nF  [C0603]  52.49 45.77 180 bottom
C1_R2  100nF  [C0603]  52.32 14.03 180 bottom
C2  100nF  [C0603]  41.3 17.96 90 top
C2_L1  100nF  [C0603]  47.37 62.66 0 bottom
C2_L2  100nF  [C0603]  45.49 31.8 180 bottom
C2_R1  100nF  [C0603]  45.75 47.68 180 bottom
C2_R2  100nF  [C0603]  45.75 15.93 180 bottom
C3  10uF  [C0603]  41.72 29.77 180 top
C4  100nF  [C0603]  41.67 31.55 180 top
C7  10uF  [C0603]  50.53 36.63 180 top
C8  100nF  [C0603]  50.53 34.47 180 top
C9  10uF  [C0603]  47.88 60.12 180 top
C10  100nF  [C0603]  47.88 57.99 180 top
C11  10uF  [C0603]  44.43 47.47 180 top
C12  100nF  [C0603]  44.43 45.47 180 top
C13  220UF  [CAP-SMD_BD8.0-L8.3-W8.3-LS9.3-FD]  24 72 270 top
C14  100nF  [C0603]  11.68 25.83 0 bottom
C15  10uF  [C0603]  11.68 23.93 0 bottom
CN1  XT30UPB-M  [CONN-TH_XT30UPB-M]  33.34 71.17 90 top
D1  SS34  [SMA_L4.3-W2.6-LS5.2-RD]  42.66 50.66 180 top
D1_L1  US1M  [SMA_L4.4-W2.8-LS5.4-RD]  40.64 59.36 180 bottom
D1_L2  US1M  [SMA_L4.4-W2.8-LS5.4-RD]  40.64 29.9 180 bottom
D1_R1  US1M  [SMA_L4.4-W2.8-LS5.4-RD]  40.64 45.01 180 bottom
D1_R2  US1M  [SMA_L4.4-W2.8-LS5.4-RD]  40.25 13.9 180 bottom
D2_L1  US1M  [SMA_L4.4-W2.8-LS5.4-RD]  40.89 54.28 180 bottom
D2_L2  US1M  [SMA_L4.4-W2.8-LS5.4-RD]  40.64 23.17 180 bottom
D2_R1  US1M  [SMA_L4.4-W2.8-LS5.4-RD]  40.89 40.19 180 bottom
D2_R2  US1M  [SMA_L4.4-W2.8-LS5.4-RD]  40.39 6.91 180 bottom
D3_L1  US1M  [SMA_L4.4-W2.8-LS5.4-RD]  32 63.17 0 bottom
D3_L2  US1M  [SMA_L4.4-W2.8-LS5.4-RD]  32 31.42 0 bottom
D3_R1  US1M  [SMA_L4.4-W2.8-LS5.4-RD]  32 46.79 0 bottom
D3_R2  US1M  [SMA_L4.4-W2.8-LS5.4-RD]  31.88 14.91 0 bottom
D4_L1  US1M  [SMA_L4.4-W2.8-LS5.4-RD]  32 54.03 0 bottom
D4_L2  US1M  [SMA_L4.4-W2.8-LS5.4-RD]  31.88 23.17 0 bottom
D4_R1  US1M  [SMA_L4.4-W2.8-LS5.4-RD]  32 40.26 0 bottom
D4_R2  US1M  [SMA_L4.4-W2.8-LS5.4-RD]  32 7.55 0 bottom
D5_L1  FR107  [SOD-123_L2.8-W1.8-LS3.7-RD]  48.51 60.63 0 bottom
D5_L2  FR107  [SOD-123_L2.8-W1.8-LS3.7-RD]  48.01 29.77 0 bottom
D5_R1  FR107  [SOD-123_L2.8-W1.8-LS3.7-RD]  48.01 45.77 0 bottom
D5_R2  FR107  [SOD-123_L2.8-W1.8-LS3.7-RD]  48.01 14.02 0 bottom
H1  PZ254V-11-05P  [HDR-TH_5P-P2.54-V-M]  2.54 32.55 270 top
L1  4.7uh  [IND-SMD_L7.3-W6.6]  41.15 56.97 270 top
LED1  NCD0603R1  [LED0603-RD_RED]  46.67 28.25 90 top
LED2  NCD0603R1  [LED0603-RD_RED]  49.42 40.44 90 top
LED3  NCD0603R1  [LED0603-RD_RED]  44.42 41.33 180 top
P1  WJ500V-5.08-2P  [CONN-TH_2P-P5.00_WJ500V-5.08-2P]  9.14 72.02 90 top
P2  WJ500V-5.08-2P  [CONN-TH_2P-P5.00_WJ500V-5.08-2P]  9.02 14.15 90 top
Q1_L1  IRFR3607TRPBF  [TO-252-3_L6.5-W5.8-P4.58-BL]  31.12 61.65 90 top
Q1_L2  IRFR3607TRPBF  [TO-252-3_L6.5-W5.8-P4.58-BL]  31.12 30.28 90 top
Q1_R1  IRFR3607TRPBF  [TO-252-3_L6.5-W5.8-P4.58-BL]  31.12 45.98 90 top
Q1_R2  IRFR3607TRPBF  [TO-252-3_L6.5-W5.8-P4.58-BL]  31.12 14.5 90 top
Q2_L1  IRFR3607TRPBF  [TO-252-3_L6.5-W5.8-P4.58-BL]  31.12 53.77 90 top
Q2_L2  IRFR3607TRPBF  [TO-252-3_L6.5-W5.8-P4.58-BL]  31.12 22.46 90 top
Q2_R1  IRFR3607TRPBF  [TO-252-3_L6.5-W5.8-P4.58-BL]  31.12 38.14 90 top
Q2_R2  IRFR3607TRPBF  [TO-252-3_L6.5-W5.8-P4.58-BL]  31.12 6.78 90 top
R1_L1  10Ω  [R0603]  40.64 61.39 180 bottom
R1_L2  10Ω  [R0603]  40.39 32.06 180 bottom
R1_R1  10Ω  [R0603]  40.64 47.17 180 bottom
R1_R2  10Ω  [R0603]  40.39 16.56 180 bottom
R2  1kΩ  [R0603]  44.47 28.25 90 top
R2_L1  10Ω  [R0603]  40.89 56.7 180 bottom
R2_L2  10Ω  [R0603]  40.64 25.96 180 bottom
R2_R1  10Ω  [R0603]  40.64 42.6 180 bottom
R2_R2  10Ω  [R0603]  40.64 9.71 180 bottom
R3  1kΩ  [R0603]  47.64 40.49 270 top
R4  10kΩ  [R0603]  49.15 47.47 0 top
R5  1kΩ  [R0603]  49.08 51.42 0 top
R6  9.1kΩ  [R0603]  49.15 49.61 0 top
R7  4.7kΩ  [R0603]  13.33 36.98 0 top
R8  4.7kΩ  [R0603]  13.33 34.98 0 top
R9  4.7kΩ  [R0603]  13.33 30.91 0 top
R10  4.7kΩ  [R0603]  13.33 32.95 0 top
R11  1kΩ  [R0603]  44.38 43.38 180 top
R12  0Ω  [R0805]  39.53 67.74 0 top
U1  AMS1117-3.3  [SOT-223-4_L6.5-W3.5-P2.30-LS7.0-BR]  44.23 36.5 180 top
U1_L1  EG2104  [SOP-8_L5.0-W4.0-P1.27-LS6.2-BL]  48.64 56.7 270 bottom
U1_L2  EG2104  [SOP-8_L5.0-W4.0-P1.27-LS6.2-BL]  48.89 25.2 270 bottom
U1_R1  EG2104  [SOP-8_L5.0-W4.0-P1.27-LS6.2-BL]  48.89 41.71 270 bottom
U1_R2  EG2104  [SOP-8_L5.0-W4.0-P1.27-LS6.2-BL]  48.76 10.21 270 bottom
U2  AMS1117-5.0  [SOT-223_L6.7-W3.5-P2.30-BR]  41.29 24.32 270 top
U3  SX1308  [SOT-23-6_L2.9-W1.6-P0.95-LS2.8-BL]  47.24 54.81 0 top
U4  XL74HC245  [SOP-20_L12.8-W7.5-P1.27-LS10.4-BL]  13.59 35.18 90 bottom
U5  HX SS12D10G4  [SW-TH_SHOU-HAN_SS12D10G4]  43.82 73.86 0 top

## Footprints (pads in the part's own frame, mm; a bottom-side part is the same pattern mirrored in y, then rotated)
C0603
  rect 0.8x0.9 smd: 1(-0.7,0) 2(0.7,0)
CAP-SMD_BD8.0-L8.3-W8.3-LS9.3-FD
  rect 4.6x1.6 smd: 1(-3.724,0) 2(3.724,0)
CONN-TH_2P-P5.00_WJ500V-5.08-2P
  round 2 hole 1.3: 1(-2.54,0) 2(2.54,0)
CONN-TH_XT30UPB-M
  round 2.5 hole 1.8: 1(-2.5,0) 2(2.5,0)
HDR-TH_5P-P2.54-V-M
  rect 1.7x1.7 hole 1.1: 1(-5.08,0)
  round 1.7 hole 1.1: 2(-2.54,0) 3(0,0) 4(2.54,0) 5(5.08,0)
IND-SMD_L7.3-W6.6
  rect 2.424x3.42 smd: 1(3.278,0) 2(-3.278,0)
LED0603-RD_RED
  rect 0.8x0.8 smd: 1(-0.799,-0.004) 2(0.799,0.004)
R0603
  rect 0.806x0.864 smd: 1(-0.753,0) 2(0.753,0)
R0805
  rect 1.133x1.377 smd: 1(-1,0) 2(1,0)
SMA_L4.3-W2.6-LS5.2-RD
  rect 2x2 smd: 1(-2.2,0) 2(2.2,0)
SMA_L4.4-W2.8-LS5.4-RD
  rect 2.046x1.62 smd: 1(-2.566,0) 2(2.566,0)
SOD-123_L2.8-W1.8-LS3.7-RD
  rect 0.95x1.15 smd: 1(-1.692,0) 2(1.692,0)
SOP-8_L5.0-W4.0-P1.27-LS6.2-BL
  oval 0.7x1.7 smd: 1(-1.905,-2.9) 2(-0.635,-2.9) 3(0.635,-2.9) 4(1.905,-2.9) 5(1.905,2.9) 6(0.635,2.9) 7(-0.635,2.9) 8(-1.905,2.9)
SOP-20_L12.8-W7.5-P1.27-LS10.4-BL
  oval 0.6x2.3 smd: 1(-5.715,-4.55) 2(-4.445,-4.55) 3(-3.175,-4.55) 4(-1.905,-4.55) 5(-0.635,-4.55) 6(0.635,-4.55) 7(1.905,-4.55) 8(3.175,-4.55) 9(4.445,-4.55) 10(5.715,-4.55) 11(5.715,4.55) 12(4.445,4.55) 13(3.175,4.55) 14(1.905,4.55) 15(0.635,4.55) 16(-0.635,4.55) 17(-1.905,4.55) 18(-3.175,4.55) 19(-4.445,4.55) 20(-5.715,4.55)
SOT-23-6_L2.9-W1.6-P0.95-LS2.8-BL
  rect 0.532x1.072 smd: 1(-0.95,-1.149) 2(0,-1.149) 3(0.95,-1.149) 4(0.95,1.149) 5(0,1.149) 6(-0.95,1.149)
SOT-223-4_L6.5-W3.5-P2.30-LS7.0-BR
  rect 2.47x0.98 smd: 1(2.835,-2.3) 2(2.835,0) 3(2.835,2.3)
  rect 2.47x3.6 smd: 4(-2.835,0)
SOT-223_L6.7-W3.5-P2.30-BR
  rect 2.2x1.1 smd: 1(3.099,-2.3) 2(3.099,0) 3(3.099,2.3)
  rect 2.2x3.5 smd: 4(-3.099,0)
SW-TH_SHOU-HAN_SS12D10G4
  oval 1.7x2.9 hole 1.1x2.3: 1(-4.8,0) 2(0,0) 3(4.8,0)
TO-252-3_L6.5-W5.8-P4.58-BL
  rect 1.27x2.54 smd: 1(-2.288,-3.747) 3(2.288,-3.745)
  rect 5.4x6.1 smd: 2(-0.002,3.747)

## Nets
As in the schematic.

Pads without a net: U1 2; U2 2; U3 6; U5 3

## Via types
v1: diameter 0.61, hole 0.305, Top Layer to Bottom Layer, 145 vias

## Routing (per net, layer and track width the routed paths; a pad name or vN(x,y) marks a point on that pad's centre or on a via; arc(x,y) is an arc through that point)
3V3: length 110.4
  Top Layer w0.635: v1(11.05,19.61) 11.05,7.93 15.88,3.1 45.85,3.1 49.83,7.09 C8.2
  Top Layer w0.762: C7.2 49.83,34.69 49.97,34.55 ; R3.2 47.64,37.08 U1.4 49.58,36.5 49.83,36.76
  Bottom Layer w0.635: 11.04,27.1 17.27,27.1 18.29,28.12 18.29,29.32 U4.20 ; 11.04,27.1 10.03,27.1 9.04,28.1 U4.1 ; 11.04,27.1 11.04,25.81 11.05,25.8 11.05,23.99 10.98,23.93 10.98,19.68 v1(11.05,19.61)
5V: length 10.6
  Top Layer w0.762: R2.1 44.4,27.42 U2.4 40.97,27.74 40.97,29.77 ; C3.2 41.02,31.5 C4.2 40.97,34.2 U1.3
12V: length 127.5
  Top Layer w0.762: 54.74,47.93 54.74,64.06 53.98,64.82 v1(53.21,64.82) ; 54.74,47.93 52.7,47.93 v1(51.82,47.04) ; 54.74,47.93 54.74,45.47 ; 44.87,50.66 44.87,50.38 45.13,50.12 C11.1 ; R11.1 45.13,43.39 C12.1 ; C11.1 C12.1 ; C11.1 48.12,47.47 48.39,47.74 ; C12.1 54.74,45.47 ; 54.74,32.74 54.74,45.47 ; 54.74,32.74 54.74,21.39 v1(53.72,20.37) ; 54.74,32.74 54.66,32.82 v1(52.96,32.82)
  Bottom Layer w0.762: v1(52.96,32.82) 52.7,32.82 51.82,31.93 51.82,29.79 C1_L2.2 ; D5_R1.2 49.71,45.77 C1_R1.2 ; C1_L2.2 D5_L2.2 ; C1_L2.2 U1_L2.1 52.96,27.1 53.85,26.22 53.85,25.2 53.21,24.56 U1_L2.3 ; 51.75,60.63 D5_L1.2 ; 51.75,60.63 51.75,58.81 U1_L1.1 52.58,58.6 53.21,57.97 53.21,56.82 52.45,56.06 51.54,56.06 ; 51.75,60.63 51.75,64.44 52.14,64.82 v1(53.21,64.82) ; 49.95,14.02 51.62,14.02 C1_R2.2 ; v1(53.72,20.37) 51.69,18.34 51.69,14.09 C1_R2.2 ; C1_R2.2 51.62,12.15 U1_R2.1 52.96,12.12 53.72,11.36 53.72,10.34 52.96,9.58 51.66,9.58 ; C1_R1.2 U1_R1.1 53.09,43.61 53.72,42.98 53.72,41.71 53.09,41.07 U1_R1.3 ; C1_R1.2 51.82,45.79 v1(51.82,47.04)
PGND:
  vias: v1(24,69.17) v1(24,66.35) v1(33.92,22.8) v1(33.94,9.07) v1(34.13,53.77) v1(34.07,24.75) v1(34.11,6.69) v1(34.22,56.06) v1(34.24,40.7) v1(34.24,38.71) v1(35.6,56.06) v1(35.58,40.7) v1(35.58,38.71) v1(35.62,9.07) v1(35.73,53.77) v1(35.69,24.95) v1(35.69,22.8) v1(35.68,6.69)
VBAT: length 49.5
  Top Layer w0.762: 47.18,60.15 47.18,58.31 47.24,58.24 ; 47.18,60.15 47.18,65.52 44.7,68 44.7,72.97 U5.2 ; 47.18,60.15 42.33,60.15 ; v1(40.13,18.72) 43.41,18.72 43.59,18.9 U2.3 ; U3.4 U3.5 47.24,57.92 C10.2 ; 42.33,60.15 41.44,60.15 ; 42.33,60.15 42.23,60.25 L1.2 ; 42.33,60.15 42.58,59.89 ; v1(29.85,18.72) 28.32,18.72 27.37,17.77 27.37,14.62
  Bottom Layer w0.762: v1(29.85,18.72) v1(40.13,18.72)
  vias: v1(25.15,63.55) v1(25.15,62.03) v1(25.15,60.37) v1(25.15,31.3) v1(25.15,29.64) v1(25.4,47.42) v1(25.4,45.59) v1(25.4,43.83) v1(25.78,16.31) v1(25.83,14.49) v1(25.78,12.63) v1(26.51,63.55) v1(26.54,62.03) v1(26.51,60.37) v1(27.37,47.42) v1(27.37,45.59) v1(27.37,43.83) v1(27.37,31.3) v1(27.37,29.64) v1(27.75,16.31) v1(27.75,14.49) v1(27.75,12.63) v1(27.88,63.55) v1(27.94,62.03) v1(27.9,60.37) v1(29.21,47.42) v1(29.21,45.59) v1(29.21,43.83) v1(29.53,29.59) v1(29.57,31.3) v1(29.73,16.28) v1(29.73,14.49) v1(29.75,12.63)
(no net):
  vias: v1(36.96,25.96) v1(36.96,24.87) v1(37.74,26.85) v1(38.86,26.85) v1(39.5,38.47) v1(39.5,37.39) v1(39.5,36.38) v1(39.75,24.54) v1(39.75,23.42) v1(40.53,37.65) v1(41.05,23.42) v1(41.16,24.53) v1(41.91,37.65) v1(43.6,38.36) v1(43.56,37.26) v1(43.56,36.25) v1(44.2,24.82) v1(44.78,38.36) v1(44.81,37.26) v1(44.79,36.25) v1(44.96,21.52) v1(45.97,22.28) v1(47.75,54.92) v1(49.53,55.93) v1(49.53,54.7) v1(49.53,53.16)
ML+: length 73.1
  Bottom Layer w0.635: C2_L1.2 48.07,62.44 48.13,62.38 48.13,57.97 46.23,56.06 45.74,56.06 ; v1(34.14,61.52) 34.82,61.52 35.08,61.78 35.08,64.59 35.56,65.08 47.12,65.08 48.13,64.06 48.13,62.98 48.01,62.85
  Bottom Layer w1.524: 29.95,53.9 31.28,53.9 32,54.63 32,62.41 32.77,63.17 D3_L1.2
  Bottom Layer w2.54: P1.2 15.49,68.21 15.49,58.98 20.32,54.16 28.7,54.16
  vias: v1(25.78,55.55) v1(25.79,53.84) v1(25.79,52.23) v1(27.37,55.54) v1(27.37,53.77) v1(27.37,52.23) v1(28.84,55.54) v1(28.84,53.84) v1(28.84,52.23) v1(34.29,63.68) v1(35.6,63.68) v1(35.62,61.52)
ML-: length 76.7
  Bottom Layer w0.635: 45.05,49.96 46.48,49.96 47.63,48.82 47.63,41.58 47.12,41.07 U1_R1.6 ; 45.05,49.96 C2_R1.2 ; 45.05,49.96 35.94,49.96 35.39,49.42 v1(35.39,48.44)
  Bottom Layer w1.524: 29.85,39.17 31.24,39.17 32,39.93 32,45.9 32.89,46.79 34.95,46.79
  Bottom Layer w2.54: 25.65,38.15 v1(25.4,38.41) 22.86,38.41 21.46,39.8 21.46,46.66 9.14,58.98 9.14,69.48
  vias: v1(25.4,40.06) v1(25.4,36.76) v1(27.25,40.06) v1(27.3,38.41) v1(27.3,36.76) v1(29.18,40.06) v1(29.21,38.41) v1(29.21,36.76) v1(34.25,46.69) v1(34.29,48.44) v1(35.43,46.54)
MR+: length 60
  Bottom Layer w0.381: 34.95,30.79 35.69,30.79
  Bottom Layer w0.508: C2_L2.2 44.79,32.22
  Bottom Layer w0.635: 35.43,31.8 35.47,31.77 35.47,31.71 35.43,31.68 ; U1_L2.6 46.99,24.56 47.75,25.33 47.75,31.8 46.48,33.07 44.66,33.07 ; 35.43,31.68 34.67,32.44 34.67,33.07 44.66,33.07 ; 35.43,31.68 35.69,31.42 ; 35.69,30.79 35.69,31.42 ; 35.69,31.42 D3_L2.2 ; 44.79,32.22 44.79,32.95 44.66,33.07
  Bottom Layer w1.524: 34.95,30.79 32.89,30.79 32.13,30.03 32.13,24.06 31.24,23.17 D4_L2.1
  Bottom Layer w2.54: P2.2 15.24,16.69 20.95,22.41 26.16,22.41
  vias: v1(25.15,23.8) v1(25.15,21.64) v1(27.37,23.8) v1(27.37,21.72) v1(29.37,23.8) v1(29.45,21.73) v1(34.16,31.93) v1(34.23,30.28) v1(35.42,31.98) v1(35.53,30.28)
MR-: length 52.5
  Bottom Layer w0.635: 45.05,17.71 46.74,17.71 47.63,16.82 47.63,10.31 46.9,9.58 45.86,9.58 ; 45.05,17.71 36.14,17.71 v1(35.5,17.07) ; 45.05,17.71 C2_R2.2
  Bottom Layer w1.524: D3_R2.2 32.99,14.91 32.13,14.05 32.13,9.55 31.01,8.44 29.49,8.44 v1(29.37,8.56)
  Bottom Layer w2.54: 26.04,7.04 21.72,7.04 17.14,11.61 P2.1
  vias: v1(25.53,8.56) v1(25.52,6.37) v1(25.53,4.62) v1(27.43,8.56) v1(27.37,6.37) v1(27.37,4.62) v1(29.45,6.37) v1(29.46,4.37) v1(33.91,17.07) v1(34.11,14.49) v1(35.54,14.49)
PWM1: length 58.5
  Top Layer w0.254: R7.2 15.37,36.98
  Bottom Layer w0.254: U1_L1.2 49.91,57.33 48.89,56.31 48.89,36.88 47.5,35.49 20.83,35.49 20.5,35.81 U4.15 16.44,35.81 15.37,36.88 v1(15.37,36.96)
PWM2: length 44.3
  Top Layer w0.254: v1(15.37,34.98) R8.2
  Bottom Layer w0.254: v1(15.37,34.98) 15.8,34.54 U4.16 18.57,34.98 48.64,34.98 50.29,36.63 50.29,41.96 50.8,42.47 51.67,42.47 U1_R1.2
PWM3: length 46
  Top Layer w0.254: 15.62,32.95 R10.2
  Bottom Layer w0.254: 15.62,32.95 15.95,33.27 U4.17 20.36,33.27 21.56,34.47 47.5,34.47 48.94,33.02 48.94,26.09 49.2,25.83 U1_L2.2
  vias: v1(15.37,32.95)
PWM4: length 60
  Top Layer w0.254: v1(15.37,31.04) 14.22,31.04 R9.2
  Bottom Layer w0.254: v1(15.37,31.04) 15.75,31.04 16.54,31.83 16.54,31.93 18.06,31.93 U4.18 20.36,32 22.32,33.96 46.74,33.96 48.54,32.16 48.54,12.47 50.17,10.85 U1_R2.2
$3N995: length 9.5
  Top Layer w0.508: Q2_L1.1 37.46,51.49 v1(38.23,52.25)
  Bottom Layer w0.508: R2_L1.2 40.01,56.57 38.99,56.57 38.33,55.91 D2_L1.2 38.23,54.18 v1(38.23,52.25)
$3N996: length 7.9
  Bottom Layer w0.508: R1_L1.1 41.4,61.4 42.54,61.4 43.31,60.63 43.31,59.46 D1_L1.1 43.21,57.69 43.56,57.33 U1_L1.7
$3N997: length 6.3
  Bottom Layer w0.381: U1_L1.5 43.97,54.79 D2_L1.1
  Bottom Layer w0.508: D2_L1.1 43.46,55.91 42.8,56.57 41.65,56.57 R2_L1.1
$3N999: length 4.8
  Bottom Layer w0.508: D5_L1.1 46.82,62.52 C2_L1.1
  Bottom Layer w0.762: D5_L1.1 46.48,60.63 45.74,59.89 U1_L1.8
$3N1006: length 8.6
  Bottom Layer w0.508: 41.11,47.17 42.67,47.17 43.05,46.79 43.05,45.16 D1_R1.1 43.21,43.72 44.58,42.34 U1_R1.7
$3N1007: length 8.5
  Top Layer w0.508: v1(37.59,43.36) 37.46,43.23 35.32,43.23 Q1_R1.1
  Bottom Layer w0.508: 39.6,47.17 38.48,47.17 37.85,46.54 37.85,45.24 D1_R1.2 38.07,43.84 v1(37.59,43.36)
$3N1008: length 6.7
  Bottom Layer w0.508: R2_R1.1 42.67,42.6 43.46,41.81 D2_R1.1 43.84,39.8 U1_R1.5
$3N1009: length 11.1
  Top Layer w0.508: Q2_R1.1 37.46,35.85 38.1,36.48 v1(38.1,36.88)
  Bottom Layer w0.508: R2_R1.2 38.86,42.6 38.1,41.84 38.1,40.41 D2_R1.2 38.1,39.96 v1(38.1,36.88)
$3N1011: length 4.4
  Bottom Layer w0.508: U1_R1.8 46.36,43.97 46.36,45.72 D5_R1.1 46.42,45.87 46.42,47.81
$3N1019: length 9.2
  Top Layer w0.381: v1(36.83,57.33) 36.32,57.33 34.86,58.79 Q1_L1.1
  Bottom Layer w0.381: D1_L1.2 38.07,57.94 37.46,57.33 v1(36.83,57.33)
  Bottom Layer w0.508: D1_L1.2 38.07,60.73 38.74,61.4 39.6,61.4
$3N2169: length 9.6
  Top Layer w0.508: Q2_L2.1 37.01,20.17 v1(37.59,20.75)
  Bottom Layer w0.508: D2_L2.2 38.07,25.43 38.61,25.96 39.63,25.96 ; v1(37.59,20.75) 37.59,22.68
  Bottom Layer w0.762: 37.59,22.68 D2_L2.2
$3N2170: length 10.2
  Bottom Layer w0.508: R1_L2.1 41.14,32.01 41.22,31.93 42.55,31.93 43.05,31.42 43.05,30.05 43.18,29.92 ; U1_L2.7 44.45,25.83 43.18,27.1 43.18,29.92 ; 43.18,29.92 43.18,30.13 43.21,30.15
$3N2171: length 7.2
  Bottom Layer w0.381: D2_L2.1 45.87,23.17 U1_L2.5
  Bottom Layer w0.508: D2_L2.1 43.18,23.19 43.18,25.2 42.42,25.96 41.14,25.96
$3N2173: length 5.1
  Bottom Layer w0.508: U1_L2.8 46.31,27.42 D5_L2.1 46.31,31.94 46.19,31.81 C2_L2.1
$3N2190: length 9.2
  Bottom Layer w0.508: 41.39,16.56 42.29,16.56 42.82,16.03 D1_R2.1 42.82,11.97 43.94,10.85 U1_R2.7
$3N2191: length 8.7
  Top Layer w0.508: 34.86,12.33 35.33,11.86 v1(36.83,11.86)
  Bottom Layer w0.508: v1(36.83,11.86) 37.69,12.72 D1_R2.2 37.69,15.77 38.48,16.56 R1_R2.2
$3N2192: length 7.5
  Bottom Layer w0.508: R2_R2.1 42.42,9.71 42.93,9.2 42.93,6.94 D2_R2.1 44.46,6.91 U1_R2.5
$3N2193: length 9.3
  Top Layer w0.508: v1(37.59,5.01) 37.08,4.5 Q2_R2.1
  Bottom Layer w0.508: R2_R2.2 38.61,9.71 37.85,8.94 37.85,6.94 D2_R2.2 37.59,6.68 v1(37.59,5.01)
$3N2195: length 4.5
  Bottom Layer w0.508: 46.57,14.02 46.37,13.82 46.37,12.63 U1_R2.8 ; 46.57,14.02 46.45,14.02 46.45,14.02 ; 46.57,14.02 46.56,14.02 46.45,14.02 ; 46.45,14.02 C2_R2.1 ; 46.45,14.02 D5_R2.1
$3N2213: length 8.1
  Top Layer w0.508: v1(37.46,27.99) 34.86,27.99 Q1_L2.1
  Bottom Layer w0.508: R1_L2.2 38.66,32.06 38.07,31.47 38.07,28.6 v1(37.46,27.99)
$3N2727: length 1.8
  Top Layer w0.762: LED2.2 49.41,41.25 47.64,41.25
$3N2731: length 2.2
  Top Layer w0.762: R2.2 46.62,29 LED1.2
$3N3245: length 8.4
  Top Layer w0.762: 42.67,53.67 42.51,53.82 ; 42.67,53.67 45.97,53.67 ; 42.67,53.67 41.18,53.67 L1.1 40.47,53.02 40.47,50.66
$3N3247: length 1.9
  Top Layer w0.762: 49.9,47.74 R6.2
$3N3248: length 4.1
  Top Layer w0.762: R6.1 48.33,49.68 R5.1 48.33,53.53 U3.3
$3N3249: length 2.1
  Top Layer w0.762: 43.53,41.32 43.63,41.42 R11.2
$3N4523: length 6.7
  Bottom Layer w0.381: H1.2 2.71,34.93 5.32,34.93 5.7,34.54 U4.5
$3N4524: length 6.8
  Bottom Layer w0.381: H1.3 3.26,33.27 U4.4
$3N4525: length 7.3
  Bottom Layer w0.381: H1.4 4.53,32 U4.3
$3N4526: length 7.8
  Bottom Layer w0.381: U4.2 5.92,30.73 2.66,27.47 H1.5

## Copper pours and planes (outline as drawn; the poured copper is in the pictures)
GND on Top Layer: 40.01,69.78 43.82,69.78 43.82,65.84 40.01,65.84
GND on Top Layer: -6.73,90.48 64.39,90.48 64.39,-12.52 -6.73,-12.52
GND on Bottom Layer: -2.03,89.84 65.66,89.84 65.66,-7.69 -2.03,-7.69
PGND on Top Layer: 22.91,70.03 39.08,70.03 39.08,6.02 22.91,6.02
PGND on Bottom Layer: 33.4,9.83 36.2,9.83 36.2,6.02 33.4,6.02
PGND on Bottom Layer: 33.4,41.33 36.17,41.33 36.17,38.13 33.4,38.13
PGND on Bottom Layer: 33.4,56.82 36.15,56.82 36.15,53.14 33.4,53.14
PGND on Bottom Layer: 33.4,25.58 36.25,25.58 36.25,22.32 33.4,22.32
VBAT on Top Layer: 17.27,83.11 47.49,83.11 47.49,11.99 17.27,11.99
VBAT on Bottom Layer: 24.26,64.44 30.48,64.44 30.48,58.98 24.26,58.98
VBAT on Bottom Layer: 24.26,48.69 30.48,48.69 30.48,43.23 24.26,43.23
VBAT on Bottom Layer: 25.02,17.33 30.48,17.33 30.48,11.86 25.02,11.86
VBAT on Bottom Layer: 24.26,32.43 30.48,32.43 30.48,27.62 24.26,27.62
ML+ on Top Layer: 33.6,64.58 36.2,64.58 36.2,60.89 33.6,60.89
ML+ on Bottom Layer: 33.59,64.19 36.2,64.19 36.2,60.89 33.59,60.89
ML+ on Bottom Layer: 24.25,56.57 30.52,56.57 30.52,51.11 24.25,51.11
ML- on Top Layer: 33.53,48.95 36.09,48.95 36.09,45.97 33.53,45.97
ML- on Bottom Layer: 24.15,41.07 30.35,41.07 30.35,36.16 24.15,36.16
ML- on Bottom Layer: 33.53,49.08 36.1,49.08 36.1,45.97 33.53,45.97
MR+ on Top Layer: 33.53,33.2 36.2,33.2 36.2,29.9 33.53,29.9
MR+ on Bottom Layer: 24.26,25.2 30.23,25.2 30.23,19.58 24.26,19.58
MR+ on Bottom Layer: 33.53,33.58 36.2,33.58 36.2,29.9 33.53,29.9
MR- on Top Layer: 33.4,17.72 36.07,17.72 36.07,14.15 33.4,14.15
MR- on Bottom Layer: 33.66,17.96 36.32,17.96 36.32,14.15 33.66,14.15
MR- on Bottom Layer: 24.38,9.58 30.19,9.58 30.19,4.12 24.38,4.12
$3N4108 on Top Layer: 23.11,77.27 40.13,77.27 40.13,72.32 23.11,72.32

Small or netless copper shapes (teardrops, artwork), in the pictures only: 58 on Top Layer, 134 on Bottom Layer

## Text on the board
Bottom Silkscreen Layer: 104 | 10欧
Top Layer: 广东工业大学 / 四五度队 / 2024
Top Silkscreen Layer: PWM2 | PWM3 | PWM4 | PWM1 | GND | 4.7k | 106 | 104 | 10k | 12v | 5v | 3.3v | 1k | 9.1k | -->ON | 0欧
